# Altium schematic sheet Sheet1.SchDoc
size A; SheetNumber: 1; SheetTotal: 2
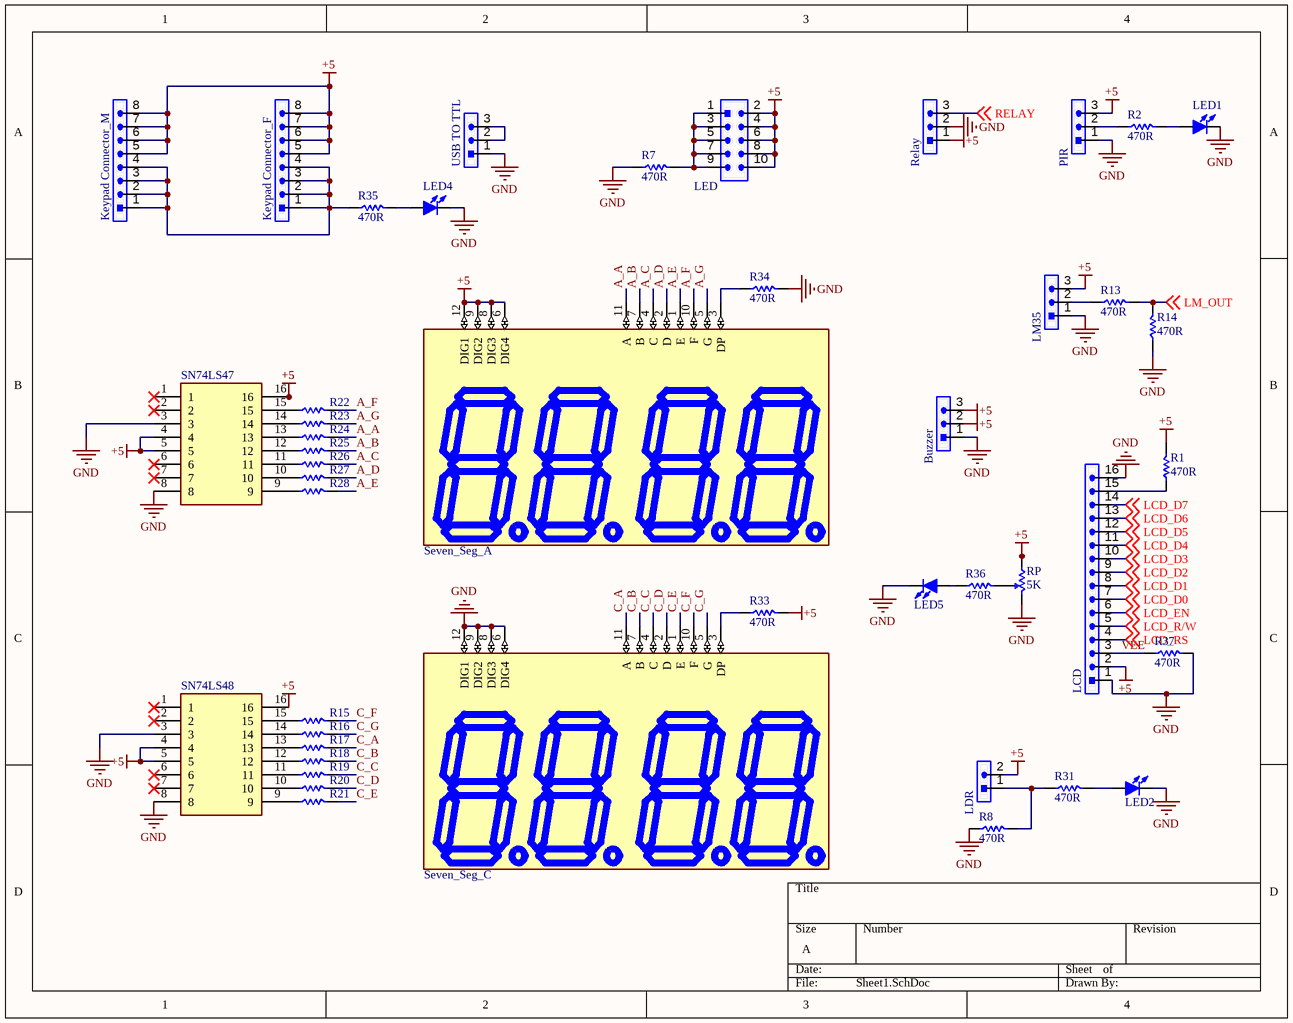
[diagram p0: Sheet1.SchDoc]

## Parts
Buzzer  HDR-1X3  [HDR-1X3_M]  (value not drawn)
Keypad_Connector_F  HDR-1X8  [HDR-1X8_M]  (value not drawn)
Keypad_Connector_M  HDR-1X8  [HDR-1X8]  (value not drawn)
LCD  HDR-1X16  [HDR-1X16]  (value not drawn)
LDR  HDR-1X2  [HDR-1X2]  (value not drawn)
LED  Header 5X2  [HDR-5X2]  (value not drawn)
LED1  LED-SMD  [LED 0805G]  (value not drawn)
LED2  LED-SMD  [LED 0805G]  (value not drawn)
LED4  LED-SMD  [LED 0805G]  (value not drawn)
LED5  LED-SMD  [LED 0805G]  (value not drawn)
LM35  HDR-1X3  [HDR-1X3_M]  (value not drawn)
PIR  HDR-1X3  [HDR-1X3_M]  (value not drawn)
R1  470R  [R 0805]
R2  470R  [R 0805]
R7  470R  [R 0805]
R8  470R  [R 0805]
R13  470R  [R 0805]
R14  470R  [R 0805]
R15  470R  [R 0805]  (value not drawn)
R16  470R  [R 0805]  (value not drawn)
R17  470R  [R 0805]  (value not drawn)
R18  470R  [R 0805]  (value not drawn)
R19  470R  [R 0805]  (value not drawn)
R20  470R  [R 0805]  (value not drawn)
R21  470R  [R 0805]  (value not drawn)
R22  470R  [R 0805]  (value not drawn)
R23  470R  [R 0805]  (value not drawn)
R24  470R  [R 0805]  (value not drawn)
R25  470R  [R 0805]  (value not drawn)
R26  470R  [R 0805]  (value not drawn)
R27  470R  [R 0805]  (value not drawn)
R28  470R  [R 0805]  (value not drawn)
R31  470R  [R 0805]
R33  470R  [R 0805]
R34  470R  [R 0805]
R35  470R  [R 0805]
R36  470R  [R 0805]
R37  470R  [R 0805]
Relay  HDR-1X3  [HDR-1X3]  (value not drawn)
RP  5K  [WH148]
Seven_Seg_A  LDQ-M3604RI  [LDQ-M3604RI]  (value not drawn)
Seven_Seg_C  LDQ-M3604RI  [LDQ-M3604RI]  (value not drawn)
SN74LS47  1571552-4  [TE_1571552-4]  (value not drawn)
SN74LS48  1571552-4  [TE_1571552-4]  (value not drawn)
USB_TO_TTL  HDR-1X3  [HDR-1X3]  (value not drawn)

## Nets
+5: Buzzer.2 Buzzer.3 Keypad_Connector_F.5 Keypad_Connector_F.6 Keypad_Connector_F.7 Keypad_Connector_F.8 Keypad_Connector_M.5 Keypad_Connector_M.6 Keypad_Connector_M.7 Keypad_Connector_M.8 LCD.2 LDR.2 LED.2 LED.4 LED.6 LED.8 LED.10 LM35.3 PIR.3 R1.2 R33.2 Relay.1 RP.1 Seven_Seg_A.6(DIG4) Seven_Seg_A.8(DIG3) Seven_Seg_A.9(DIG2) Seven_Seg_A.12(DIG1) SN74LS47.4 SN74LS47.5 SN74LS47.16 SN74LS48.4 SN74LS48.5 SN74LS48.16
GND: Buzzer.1 LCD.1 LCD.16 LED1.2(K) LED2.2(K) LED4.2(K) LED5.2(K) LM35.1 PIR.1 R7.1 R8.1 R14.1 R34.2 R37.2 Relay.2 RP.2 Seven_Seg_C.6(DIG4) Seven_Seg_C.8(DIG3) Seven_Seg_C.9(DIG2) Seven_Seg_C.12(DIG1) SN74LS47.3 SN74LS47.8 SN74LS48.3 SN74LS48.8 USB_TO_TTL.1
A_A: R24.2 Seven_Seg_A.11(A)
A_B: R25.2 Seven_Seg_A.7(B)
A_C: R26.2 Seven_Seg_A.4(C)
A_D: R27.2 Seven_Seg_A.2(D)
A_E: R28.2 Seven_Seg_A.1(E)
A_F: R22.2 Seven_Seg_A.10(F)
A_G: R23.2 Seven_Seg_A.5(G)
C_A: R17.2 Seven_Seg_C.11(A)
C_B: R18.2 Seven_Seg_C.7(B)
C_C: R19.2 Seven_Seg_C.4(C)
C_D: R20.2 Seven_Seg_C.2(D)
C_E: R21.2 Seven_Seg_C.1(E)
C_F: R15.2 Seven_Seg_C.10(F)
C_G: R16.2 Seven_Seg_C.5(G)
LCD_D0: LCD.7 ; off-sheet LCD_D0
LCD_D1: LCD.8 ; off-sheet LCD_D1
LCD_D2: LCD.9 ; off-sheet LCD_D2
LCD_D3: LCD.10 ; off-sheet LCD_D3
LCD_D4: LCD.11 ; off-sheet LCD_D4
LCD_D5: LCD.12 ; off-sheet LCD_D5
LCD_D6: LCD.13 ; off-sheet LCD_D6
LCD_D7: LCD.14 ; off-sheet LCD_D7
LCD_EN: LCD.6 ; off-sheet LCD_EN
LCD_R/W: LCD.5 ; off-sheet LCD_R/W
LCD_RS: LCD.4 ; off-sheet LCD_RS
LM_OUT: R13.2 R14.2 ; off-sheet LM_OUT
RELAY: Relay.3 ; off-sheet RELAY
VEE: LCD.3 R37.1
NetKeypad_Connector_F_1: Keypad_Connector_F.1 Keypad_Connector_F.2 Keypad_Connector_F.3 Keypad_Connector_F.4 Keypad_Connector_M.1 Keypad_Connector_M.2 Keypad_Connector_M.3 Keypad_Connector_M.4 R35.1
NetLCD_15: LCD.15 R1.1
NetLDR_1: LDR.1 R8.2 R31.1
NetLED1_1: LED1.1(A) R2.2
NetLED2_1: LED2.1(A) R31.2
NetLED4_1: LED4.1(A) R35.2
NetLED5_1: LED5.1(A) R36.1
NetLED_1: LED.1 LED.3 LED.5 LED.7 LED.9 R7.2
NetLM35_2: LM35.2 R13.1
NetPIR_2: PIR.2 R2.1
NetR15_1: R15.1 SN74LS48.15
NetR16_1: R16.1 SN74LS48.14
NetR17_1: R17.1 SN74LS48.13
NetR18_1: R18.1 SN74LS48.12
NetR19_1: R19.1 SN74LS48.11
NetR20_1: R20.1 SN74LS48.10
NetR21_1: R21.1 SN74LS48.9
NetR22_1: R22.1 SN74LS47.15
NetR23_1: R23.1 SN74LS47.14
NetR24_1: R24.1 SN74LS47.13
NetR25_1: R25.1 SN74LS47.12
NetR26_1: R26.1 SN74LS47.11
NetR27_1: R27.1 SN74LS47.10
NetR28_1: R28.1 SN74LS47.9
NetR33_1: R33.1 Seven_Seg_C.3(DP)
NetR34_1: R34.1 Seven_Seg_A.3(DP)
NetR36_2: R36.2 RP.ADJ
NetUSB_TO_TTL_2: USB_TO_TTL.2 USB_TO_TTL.3

Not connected (* = marked no-connect by the designer): SN74LS47 1* 2* 6* 7*; SN74LS48 1* 2* 6* 7*

## Library data of the parts
Buzzer LM35 PIR Relay USB_TO_TTL = Header 3: 3P Connector; BOM名称: 3P接插件; 版权归属: 源创客; 学习资源: www.ooocke.com
Keypad_Connector_F Keypad_Connector_M = Header 8: 8P Connector; BOM名称: 8P接插件; 版权归属: 源创客; 学习资源: www.ooocke.com
LCD = Header 16: 16P Connector; BOM名称: 16P接插件; 版权归属: 源创客; 学习资源: www.ooocke.com
LDR = Header 2: 2P Connector; BOM名称: 2P接插件; 版权归属: 源创客; 学习资源: www.ooocke.com
LED = Header 5X2: 5*2P Connector; BOM名称: 5*2P接插件; 版权归属: 源创客; 学习资源: www.ooocke.com
LED1 LED2 LED4 LED5 = LED-SMD: Patch LED; BOM名称: 贴片LED; 版权归属: 源创客; 学习资源: www.ooocke.com
R1 R2 R7 R8 R13-R28 R31 R33-R37 = R: Chip resistor; 版权归属: 源创客; BOM名称: Chip resistor; 学习资源: www.ooocke.com
RP = RP-THD: Plug-in potentiometer; BOM名称: 插件电位器; 版权归属: 源创客; 学习资源: www.ooocke.com
Seven_Seg_A Seven_Seg_C = LDQ-M3604RI: Display, Seven Segment, 9.2MM, Red; MF: Lumex; Package: None; MP: LDQ-M3604RI; Price: None; Availability: Warning; Value: *; Check_prices: https://www.snapeda.com/parts/LDQ-M3604RI/Lumex/view-part/2854791/?ref=eda; SnapEDA_Link: https://www.snapeda.com/parts/LDQ-M3604RI/Lumex/view-part/2854791/?ref=snap
SN74LS47 SN74LS48 = 1571552-4: Row Spacing 2.54 mm Pitch Through Hole Dip Socket; Package: None; Price: None; Value: *; MP: 1571552-4; Availability: Unavailable